# EAGLE design TDA7492 (EAGLE 9.1.2)
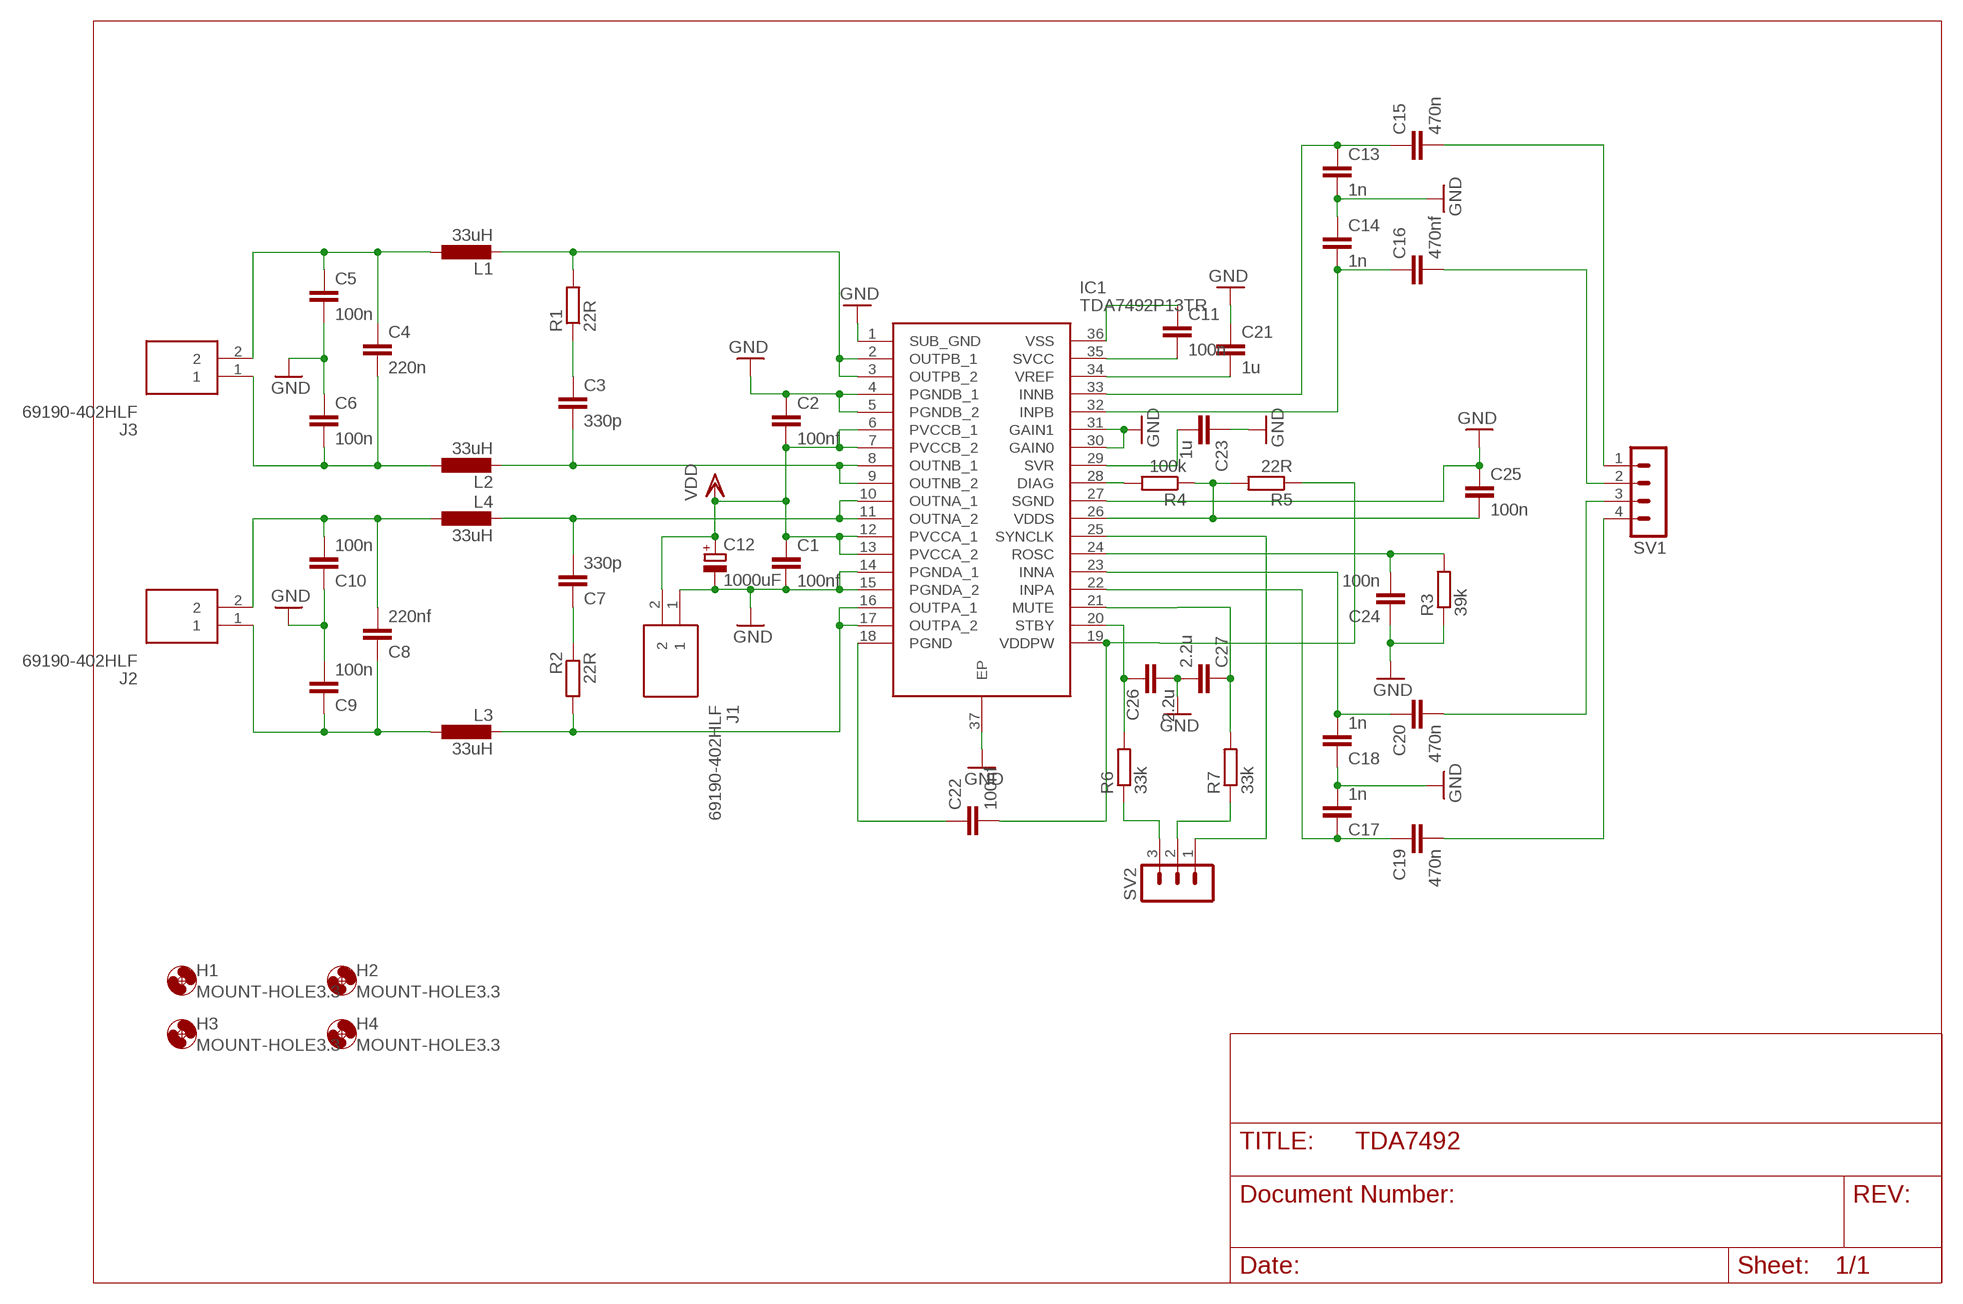
[diagram p0: schematic, sheet 1]

## Parts
C1  100nf  C-EUC0805  [C0805]
C2  100nf  C-EUC0805  [C0805]
C3  330p  C-EUC0805  [C0805]
C4  220n  C-EUC0805  [C0805]
C5  100n  C-EUC0805  [C0805]
C6  100n  C-EUC0805  [C0805]
C7  330p  C-EUC0805  [C0805]
C8  220nf  C-EUC0805  [C0805]
C9  100n  C-EUC0805  [C0805]
C10  100n  C-EUC0805  [C0805]
C11  100n  C-EUC0805  [C0805]
C12  1000uF  CPOL-EUE7.5-16  [E7,5-16]
C13  1n  C-EUC0805  [C0805]
C14  1n  C-EUC0805  [C0805]
C15  470n  C-EUC0805  [C0805]
C16  470nf  C-EUC0805  [C0805]
C17  1n  C-EUC0805  [C0805]
C18  1n  C-EUC0805  [C0805]
C19  470n  C-EUC0805  [C0805]
C20  470n  C-EUC0805  [C0805]
C21  1u  C-EUC0805  [C0805]
C22  100nf  C-EUC0805  [C0805]
C23  1u  C-EUC0805  [C0805]
C24  100n  C-EUC0805  [C0805]
C25  100n  C-EUC0805  [C0805]
C26  2.2u  C-EUC0805  [C0805]
C27  2.2u  C-EUC0805  [C0805]
H1  MOUNT-HOLE3.3  [3,3]
H2  MOUNT-HOLE3.3  [3,3]
H3  MOUNT-HOLE3.3  [3,3]
H4  MOUNT-HOLE3.3  [3,3]
IC1  TDA7492P13TR  [SOP50P1030X245-37N]
J1  69190-402HLF  [HDRV2W90P0X254_1X2_508X241X858]
J2  69190-402HLF  [HDRV2W90P0X254_1X2_508X241X858]
J3  69190-402HLF  [HDRV2W90P0X254_1X2_508X241X858]
L1  33uH  L-EUWE-TPC  [POWER-CHOKE_WE-TPC]
L2  33uH  L-EUWE-TPC  [POWER-CHOKE_WE-TPC]
L3  33uH  L-EUWE-TPC  [POWER-CHOKE_WE-TPC]
L4  33uH  L-EUWE-TPC  [POWER-CHOKE_WE-TPC]
R1  22R  R-EU_R0805  [R0805]
R2  22R  R-EU_R0805  [R0805]
R3  39k  R-EU_R0805  [R0805]
R4  100k  R-EU_R0805  [R0805]
R5  22R  R-EU_R0805  [R0805]
R6  33k  R-EU_R0805  [R0805]
R7  33k  R-EU_R0805  [R0805]
SV1  MA04-1  [MA04-1]
SV2  MA03-1  [MA03-1]

## Nets
GND: C1.2 C2.1 C5.2 C6.1 C9.2 C10.1 C12.- C13.2 C14.1 C17.2 C18.1 C21.1 C23.1 C24.1 C25.1 C26.2 C27.2 IC1.1(SUB_GND) IC1.4(PGNDB_1) IC1.5(PGNDB_2) IC1.14(PGNDA_1) IC1.15(PGNDA_2) IC1.27(SGND) IC1.30(GAIN0) IC1.31(GAIN1) IC1.37(EP) J1.1 R3.1
N$1: C4.2 C6.2 J3.1 L2.1
N$2: C4.1 C5.1 J3.2 L1.1
N$3: IC1.2(OUTPB_1) IC1.3(OUTPB_2) L1.2 R1.2
N$4: IC1.16(OUTPA_1) IC1.17(OUTPA_2) L3.2 R2.2
N$5: C3.2 IC1.8(OUTNB_1) IC1.9(OUTNB_2) L2.2
N$6: C11.2 IC1.35(SVCC)
N$7: C24.2 IC1.24(ROSC) R3.2
N$8: C3.1 R1.1
N$9: C23.2 IC1.29(SVR)
N$10: C14.2 C16.1 IC1.32(INPB)
N$11: C7.2 IC1.10(OUTNA_1) IC1.11(OUTNA_2) L4.2
N$12: C8.2 C10.2 J2.2 L4.1
N$13: C8.1 C9.1 J2.1 L3.1
N$14: C7.1 R2.1
N$15: C11.1 IC1.36(VSS)
N$16: C13.1 C15.1 IC1.33(INNB)
N$17: C22.1 IC1.18(PGND)
N$18: C17.1 C19.1 IC1.22(INPA)
N$19: C21.2 IC1.34(VREF)
N$20: C18.2 C20.1 IC1.23(INNA)
N$21: C22.2 IC1.19(VDDPW) R5.1
N$22: C15.2 SV1.1
N$23: C16.2 SV1.2
N$24: C20.2 SV1.3
N$25: C19.2 SV1.4
N$27: C27.1 IC1.21(MUTE) R7.2
N$28: IC1.28(DIAG) R4.2
N$29: C25.2 IC1.26(VDDS) R4.1 R5.2
N$30: IC1.25(SYNCLK) SV2.1
N$32: C26.1 IC1.20(STBY) R6.2
N$33: R6.1 SV2.3
N$34: R7.1 SV2.2
VDD: C1.1 C2.2 C12.+ IC1.6(PVCCB_1) IC1.7(PVCCB_2) IC1.12(PVCCA_1) IC1.13(PVCCA_2) J1.2

## Library data of the parts
C1-C11 C13-C27 = rcl-vito:C-EU: CAPACITOR, European symbol
C12 = rcl-vito:CPOL-EU: POLARIZED CAPACITOR, European symbol
H1-H4 = holes:MOUNT-HOLE: MOUNTING HOLE with drill center marker
IC1 = TDA7492P13TR:TDA7492P13TR: Audio Amplifiers 50W Mono BTL Class D 10 to 26V 4Select dB Source: Datasheet <https://componentsearchengine.com//TDA7492P13TR.pdf>; DESCRIPTION: Audio Amplifiers 50W Mono BTL Class D 10 to 26V 4Select dB; HEIGHT: 2.45mm; MANUFACTURER_NAME: STMicroelectronics; MANUFACTURER_PART_NUMBER: TDA7492P13TR; MOUSER2_PART_NUMBER: 511-TDA7492P13TR; MOUSER2_PRICE-STOCK: https://www.mouser.com/Search/Refine.aspx?Keyword=511-TDA7492P13TR
J1-J3 = 69190-402HLF:69190-402HLF: FCI,Header 2 way unshrouded FCI, Series Number 69190, 2.54mm Pitch 2 Way 1 Row Straight Header, Solder Termination Source: Datasheet <https://cdn.amphenol-icc.com/media/wysiwyg/files/drawing/69190.pdf>; ALLIED_NUMBER: 70302517; ALLIED_PRICE-STOCK: https://www.alliedelec.com/amphenol-fci-69190-402hlf/70302517/; ARROW_PART_NUMBER: 69190-402HLF; ARROW_PRICE-STOCK: https://www.arrow.com/en/products/69190-402hlf/amphenol-fci; DESCRIPTION: FCI,Header 2 way unshrouded FCI, Series Number 69190, 2.54mm Pitch 2 Way 1 Row Straight Header, Solder Termination; HEIGHT: 8.58mm; MANUFACTURER_NAME: FCI; MANUFACTURER_PART_NUMBER: 69190-402HLF; RS_PART_NUMBER: 8632731; RS_PRICE-STOCK: http://uk.rs-online.com/web/p/products/8632731
L1-L4 = rcl-vito:L-EU: INDUCTOR, European symbol
R1-R7 = rcl-vito:R-EU_: RESISTOR, European symbol
SV1 = con-lstb:MA04-1: PIN HEADER; OC_FARNELL: unknown; OC_NEWARK: unknown
SV2 = con-lstb:MA03-1: PIN HEADER; OC_FARNELL: unknown; OC_NEWARK: unknown

## Board
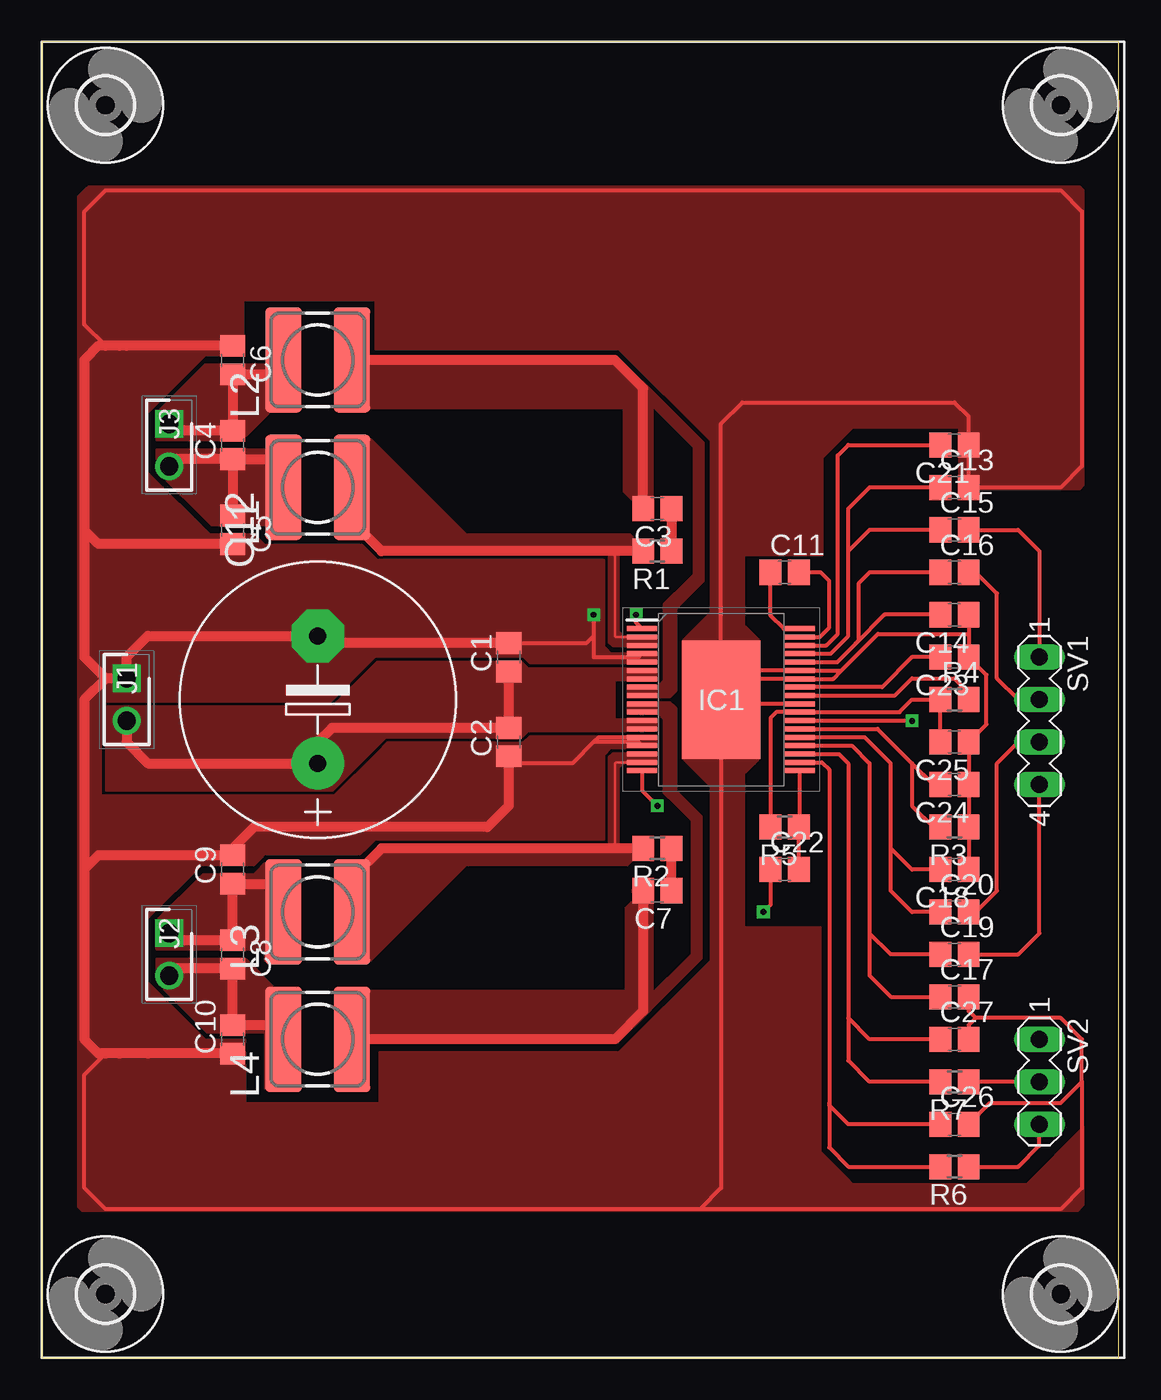
[diagram p1: board, top side]
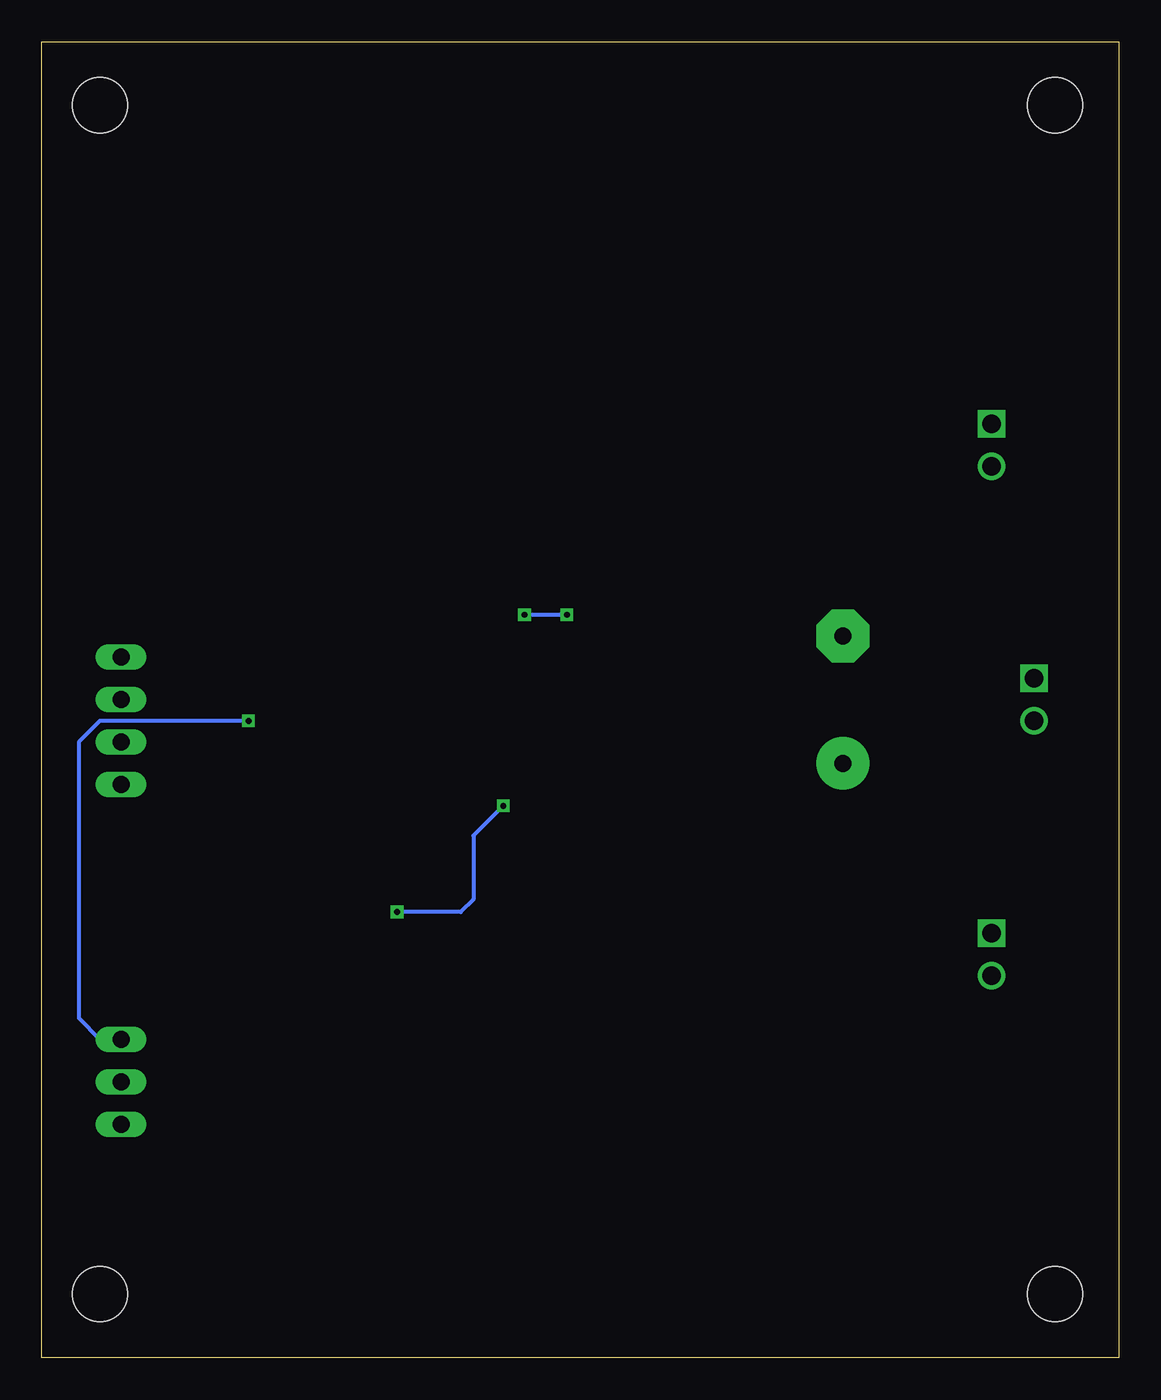
[diagram p2: board, bottom side, seen from below]

Size 64.44 x 78.73 mm. Coordinates in mm from the lower left corner, seen from the top.
Outline: 0,0 64.44,0 64.44,78.73 0,78.73 0,0
Copper layers (1*16): Top 0.035mm / dielectric 1.5mm / Bottom 0.035mm
Design rules "default *": minimum track width 6mil, minimum drill 0.35mm, track to track 6mil, track to pad 6mil, pad to pad 6mil, via to via 6mil, smd to smd 6mil, copper to edge 40mil, drill to drill 6mil, minimum pad ring 10mil, minimum via ring 8mil, stop-mask expansion 4mil, vias tented up to drill 0mil, thermal gap 0mil

### Footprints (pad centres in the part's own frame; a part is rotated, then mirrored left to right if it is on the bottom)
C0805 = smd 1.3 x 1.5: 1 -0.85,0; 2 0.85,0
E7,5-16 = drill 1.016 pad 3.15: + -3.81,0 | drill 1.016 pad 3.15 octagon: - 3.81,0
3,3 = hole 3.3: 0,0
SOP50P1030X245-37N = smd 1.8 x 0.3: 1 -4.725,4.25; 2 -4.725,3.75; 3 -4.725,3.25; 4 -4.725,2.75; 5 -4.725,2.25; 6 -4.725,1.75; 7 -4.725,1.25; 8 -4.725,0.75; 9 -4.725,0.25; 10 -4.725,-0.25; 11 -4.725,-0.75; 12 -4.725,-1.25; 13 -4.725,-1.75; 14 -4.725,-2.25; 15 -4.725,-2.75; 16 -4.725,-3.25; 17 -4.725,-3.75; 18 -4.725,-4.25; 19 4.725,-4.25; 20 4.725,-3.75; 21 4.725,-3.25; 22 4.725,-2.75; 23 4.725,-2.25; 24 4.725,-1.75; 25 4.725,-1.25; 26 4.725,-0.75; 27 4.725,-0.25; 28 4.725,0.25; 29 4.725,0.75; 30 4.725,1.25; 31 4.725,1.75; 32 4.725,2.25; 33 4.725,2.75; 34 4.725,3.25; 35 4.725,3.75; 36 4.725,4.25 | smd 4.7 x 7.1: 37 0,0
HDRV2W90P0X254_1X2_508X241X858 = drill 1.1 pad 1.65 square: 1 0,0 | drill 1.1 pad 1.65: 2 2.54,0
POWER-CHOKE_WE-TPC = smd 6.3 x 2.2: 1 0,2.05; 2 0,-2.05
R0805 = smd 1.3 x 1.5: 1 -0.85,0; 2 0.85,0
MA04-1 = drill 1.016 long: 1 -3.81,0; 2 -1.27,0; 3 1.27,0; 4 3.81,0
MA03-1 = drill 1.016 long: 1 -2.54,0; 2 0,0; 3 2.54,0

### Placement (x,y rotation side)
C1  27.94,41.91 90 top
C2  27.94,36.83 90 top
C3  36.83,50.8 180 top
C4  11.43,54.61 90 top
C5  11.43,49.53 270 top
C6  11.43,59.69 270 top
C7  36.83,27.94 180 top
C8  11.43,24.13 270 top
C9  11.43,29.21 90 top
C10  11.43,19.05 90 top
C11  44.45,46.99 0 top
C12  16.51,39.37 90 top
C13  54.61,52.07 0 top
C14  54.61,44.45 180 top
C15  54.61,49.53 0 top
C16  54.61,46.99 0 top
C17  54.61,21.59 0 top
C18  54.61,29.21 180 top
C19  54.61,24.13 0 top
C20  54.61,26.67 0 top
C21  54.61,54.61 180 top
C22  44.45,29.21 0 top
C23  54.61,41.91 180 top
C24  54.61,34.29 180 top
C25  54.61,36.83 180 top
C26  54.61,13.97 0 top
C27  54.61,19.05 0 top
H1  3.81,3.81 0 top
H2  3.81,74.93 0 top
H3  60.96,3.81 0 top
H4  60.96,74.93 0 top
IC1  40.64,39.37 0 top
J1  5.08,40.64 270 top
J2  7.62,25.4 270 top
J3  7.62,55.88 270 top
L1  16.51,52.07 90 top
L2  16.51,59.69 90 top
L3  16.51,26.67 90 top
L4  16.51,19.05 90 top
R1  36.83,48.26 180 top
R2  36.83,30.48 180 top
R3  54.61,31.75 180 top
R4  54.61,39.37 0 top
R5  44.45,31.75 180 top
R6  54.61,11.43 180 top
R7  54.61,16.51 180 top
SV1  59.69,38.1 270 top
SV2  59.69,16.51 270 top

### Tracks (layer width: path | path; a pad name or v marks a point on that pad's centre or on a via)
GND  (via drill 0.35)
  Top 0.254: C26.2 56.73,15.24 60.96,15.24 62.23,16.51 | C18.1 R3.1 C24.1 C25.1 56.52,37.88 56.52,40.85 C23.1 55.46,43.31 | 62.23,16.51 62.23,19.05 60.96,20.32 55.88,20.32 | 55.88,20.32 55.46,20.74 C17.2 | 55.88,20.32 55.46,19.9 C27.2 | C14.1 55.46,43.31 | 47.85,41.12 IC1.31 42.39,41.12 41.91,40.64 | 55.46,43.31 50.04,43.31 47.85,41.12 | 47.85,41.12 47.35,40.62 IC1.30 41.93,40.62 41.91,40.64 | IC1.37 40.64,40.64 | 40.64,40.64 40.64,55.88 41.91,57.15 54.61,57.15 55.46,56.3 C21.1 C13.2 60.96,52.07 62.23,53.34 62.23,68.58 60.96,69.85 3.81,69.85 2.54,68.58 2.54,61.81 3.81,60.54 | 41.91,40.64 40.64,40.64 | IC1.27 40.89,39.12 IC1.37 | IC1.1 35.56,43.98 v35.56,44.45 | v33.02,44.45 33.02,43.18 | 33.02,43.18 33.02,41.91 35.7,41.91 IC1.4 | C1.2 32.6,42.76 33.02,43.18 | IC1.14 33.31,37.12 33.02,36.83 | 33.02,36.83 31.75,35.56 27.94,35.56 | IC1.15 35.7,36.83 33.02,36.83 | 62.23,16.51 62.23,10.16 60.96,8.89 39.37,8.89 | 3.81,18.2 2.54,16.93 2.54,10.16 3.81,8.89 39.37,8.89 | IC1.37 40.64,10.16 39.37,8.89
  Top 0.61: C6.1 5.08,60.54 | 5.08,60.54 4.66,60.54 | C1.2 16.93,42.76 C12.- 6.35,43.18 5.08,41.91 J1.1 3.81,40.64 | 5.08,30.06 C9.2 11.43,30.48 12.7,31.75 26.67,31.75 27.94,33.02 27.94,35.56 C2.1 | 5.08,30.06 4.66,30.06 | C10.1 6.35,18.2 | 6.35,18.2 4.66,18.2 | 2.54,29.21 2.54,38.1 2.54,39.37 3.81,40.64 | 2.54,29.21 2.54,19.05 3.39,18.2 3.81,18.2 6.35,18.2 | 3.81,40.64 2.54,41.91 2.54,49.53 | 5.08,60.54 3.81,60.54 3.39,60.54 2.54,59.69 2.54,49.53 | 2.54,49.53 3.39,48.68 C5.2 | 5.08,30.06 3.39,30.06 2.54,29.21
  Bottom 0.254: v35.56,44.45 v33.02,44.45
  pour Top: 38.35,35.81 40.01,34.16 40.01,30.35 40.01,10.79 38.35,9.14 38.35,8.76 42.29,8.76 42.8,8.76 42.93,8.76 42.93,9.14 41.27,10.79 41.27,34.16 42.93,35.81
  pour Top: 2.54,19.05 12.19,19.05 12.19,17.65 12.19,15.24 15.24,15.24 46.61,15.24 46.61,13.46 46.61,12.32 48.13,10.79 48.51,10.41 57.4,10.41 62.23,10.41 62.36,10.29 62.36,10.03 61.09,8.76 60.71,8.76 2.92,8.76 2.41,9.27 2.41,10.29 2.54,10.41
  pour Top: 40.01,23.75 34.54,18.29 33.27,18.29 20.7,18.29 20.19,18.29 20.19,15.11 46.61,15.11 46.61,19.18 46.61,25.53 46.61,25.78 42.04,25.78 42.04,70.1 41.02,70.1 40.01,70.1 40.01,26.29
  pour Top: 2.92,8.76 2.16,9.53 2.16,68.45 3.68,69.98 42.04,69.98 38.1,66.04 11.81,66.04 6.22,66.04 2.67,62.48 2.92,62.23 2.92,9.4
  pour Top: 40.01,44.58 40.01,45.85 42.04,45.85 42.04,44.7 42.04,43.81
  pour Top: 40.26,44.83 40.39,44.83 41.02,44.83
  pour Top: 36.07,37.08 36.07,37.21 33.27,37.21 29.21,37.21 28.83,36.83 27.69,36.83 21.08,36.83 20.7,36.83 20.07,36.2 17.53,33.66 5.59,33.66 3.56,33.66 3.56,34.29 3.56,39.24 3.94,39.24 16.89,39.24 17.27,39.24 19.56,41.53 19.94,41.91 28.7,41.91 28.83,41.91 29.21,41.53 36.83,41.53 36.83,42.16 34.04,42.16 33.78,42.42 33.66,42.55 33.66,43.18 33.66,47.75 33.27,47.75 20.07,47.75 19.18,48.64 17.14,48.64 13.34,48.64 12.7,49.28 12.19,49.28 10.03,49.28 6.35,52.96 6.35,56.52 9.78,59.94 12.06,59.94 12.06,61.09 2.16,61.09 2.16,59.94 2.16,29.97 5.08,29.97 10.41,29.97 10.92,29.46 12.19,29.46 12.7,29.46 13.08,29.84 13.34,30.1 14.99,30.1 19.05,30.1 19.43,30.48 19.94,30.99 20.45,30.99 33.66,30.99 33.66,31.5 33.66,36.07 34.04,36.45 35.94,36.45 36.07,36.45
  pour Top: 34.92,36.45 36.83,36.45 36.83,37.21 34.92,37.21
  pour Top: 38.35,42.93 40.01,44.58 40.64,44.58 41.27,44.58 42.93,42.93 42.93,42.67 38.35,42.67
  pour Top: 40.01,54.86 34.54,60.33 33.91,60.33 20.32,60.33 19.94,60.33 19.94,60.96 19.94,63.25 16.26,63.25 12.06,63.25 12.06,59.94 2.41,59.94 2.41,63.5 2.29,63.5 2.16,63.63 2.16,69.47 2.67,69.98 2.79,70.1 3.94,70.1 62.1,70.1 62.36,69.85 62.36,52.2 62.1,51.94 54.99,51.94 54.86,52.07 54.86,55.63 53.59,55.63 48.51,55.63 47.24,54.36 46.74,53.85 46.74,48.01 42.04,48.01 40.77,48.01 40.77,53.72 40.01,53.72
  pour Top: 60.96,8.76 61.98,8.76 62.23,9.02 62.36,9.14 62.36,10.29 62.36,13.84 58.93,10.41 56.39,10.41 55.88,9.91 55.88,8.89 56.01,8.76
  pour Top: 3.05,8.76 2.41,8.76 2.16,9.02 2.16,10.67 2.29,10.79 3.3,10.79 3.43,10.67 3.43,9.02 3.17,8.76
  pour Top: 6.35,30.48 6.35,19.05 2.54,19.05 2.54,31.75 6.35,31.75
  pour Top: 6.22,22.86 6.35,22.73 6.35,22.48 9.78,19.05 5.46,19.05 5.46,30.48 10.16,30.48 10.16,29.84 10.41,29.84 10.92,30.35 11.43,30.35 11.43,29.84 11.43,29.46 10.29,29.46 9.53,29.46 6.35,26.29 6.35,22.99
N$1
  Top 0.61: L2.1 15.24,59.69 14.39,58.84 C6.2 C4.2 8.04,55.46 J3.1
  pour Top: 12.06,54.99 13.72,56.64 13.84,56.64 13.84,59.31 13.72,59.44 10.67,59.44 9.78,59.44 6.86,56.52 6.86,54.99 6.86,54.86 11.94,54.86
N$2
  Top 0.61: C4.1 C5.1 | C4.1 13.55,53.76 14.46,52.85 L1.1 | C4.1 8.04,53.76 J3.2
  pour Top: 13.72,54.36 10.67,54.36 6.86,54.36 6.86,53.09 10.16,49.78 11.18,49.78 13.72,49.78
N$3
  Top 0.152: IC1.2 34.35,43.12 34.29,43.18 34.29,48.26
  Top 0.61: R1.2 34.29,48.26 20.32,48.26 18.56,50.02 L1.2
  pour Top: 36.83,42.55 34.8,42.55 34.16,42.55 33.91,42.8 33.91,48.26 34.04,48.39 34.8,48.39 34.54,48.13 34.54,43.43 34.67,43.31 34.8,43.18 36.45,43.18 36.83,43.18
  pour Top: 36.45,48.9 25.78,48.9 19.56,55.12 17.78,55.12 17.65,54.99 17.65,50.67 19.56,48.77 20.19,48.13 36.2,48.13 36.45,48.39
  pour Top: 35.56,48.9 35.18,49.28 34.8,49.28 25.15,49.28 25.02,49.15 25.91,48.26 26.04,48.26 34.92,48.26
N$4
  Top 0.152: IC1.17 34.35,35.62 34.29,35.56 34.29,30.48
  Top 0.61: R2.2 34.29,30.48 20.32,30.48 18.56,28.72 L3.2
  pour Top: 36.58,36.2 34.29,36.2 34.16,36.2 33.91,35.94 33.91,30.48 34.54,30.48 34.54,34.04 34.54,35.31 34.8,35.56 36.7,35.56 36.83,35.56 36.83,36.2
  pour Top: 18.41,23.62 19.56,23.62 19.68,23.75 26.16,30.23 26.54,30.23 36.58,30.23 36.58,30.73 20.32,30.73 20.07,30.48 18.41,28.83
  pour Top: 35.81,30.1 35.69,30.1 35.05,29.46 20.45,29.46 20.45,30.61 36.07,30.61 36.07,30.1 35.94,30.1
N$5
  Top 0.61: C3.2 35.98,58 34.29,59.69 L2.2
  pour Top: 35.05,40.26 35.05,39.5 36.7,39.5 37.59,39.5 37.97,39.88 37.97,44.83 39.62,46.48 39.62,54.74 35.94,58.42 35.69,58.17 35.56,58.04 35.94,57.66 35.94,57.53 36.07,57.4 38.99,54.48 38.99,54.36 38.99,46.86 38.61,46.48 37.21,45.09 37.21,44.32 37.21,40.51 36.96,40.26
  pour Top: 18.54,56.64 19.43,56.64 19.56,56.64 19.68,56.77 22.35,59.44 24.64,59.44 27.3,59.44 27.69,59.82 19.18,59.82 18.92,59.56 18.54,59.18
  pour Top: 35.43,50.16 35.43,51.18 34.8,51.82 34.8,57.66 34.29,58.17 33.91,58.55 21.46,58.55 21.46,59.44 21.34,59.56 34.16,59.56 35.81,57.91 36.58,57.15 36.58,51.44 36.58,50.16
  pour Top: 19.05,62.23 19.05,59.69 34.29,59.69 35.56,58.42 35.56,57.15 19.05,57.15 17.78,57.15 17.78,62.23
  pour Top: 19.05,57.15 17.78,57.15 17.78,62.23 19.05,62.23 19.05,59.69 34.29,59.69 34.29,58.42 35.56,58.42 35.56,57.15 35.56,56.77 19.43,56.77 18.92,56.77 18.92,56.9 19.05,56.9
N$6
  Top 0.254: IC1.35 46.55,43.12 47.12,43.69 47.12,46.48 46.61,46.99 C11.2
N$7
  Top 0.254: IC1.24 50.01,37.62 52.07,35.56 | R3.2 53.34,31.75 52.07,33.02 52.07,35.56 | C24.2 53.34,34.29 52.07,35.56
N$8
  Top 0.61: C3.1 R1.1
N$9
  Top 0.254: C23.2 52.07,41.91 50.28,40.12 IC1.29
N$10
  Top 0.254: C16.1 49.53,46.99 48.9,46.35 48.9,42.93 48.7,42.74 | IC1.32 47.59,41.62 48.7,42.74 | C14.2 50.42,44.45 48.7,42.74
N$11
  Top 0.61: C7.2 35.98,20.74 34.29,19.05 L4.2
  pour Top: 35.05,39.24 37.59,39.24 37.85,38.99 37.97,38.86 37.97,33.91 38.23,33.66 39.5,32.38 39.5,26.16 39.5,23.88 35.94,20.32 35.69,20.57 35.56,20.7 36.07,21.21 36.07,21.34 38.86,24.13 38.86,24.64 38.86,32.13 37.85,33.15 37.21,33.78 37.21,34.92 37.21,38.23 36.96,38.48 35.05,38.48
  pour Top: 18.67,21.97 19.56,21.97 22.23,19.3 23.11,19.3 33.91,19.3 35.69,21.08 35.69,27.3 36.2,27.3 36.58,27.3 36.58,20.95 36.32,20.7 34.42,18.8 18.54,18.8 18.67,18.92
  pour Top: 36.58,28.7 35.31,28.7 35.31,27.3 34.92,26.92 34.92,21.97 17.65,21.97 17.65,20.32 18.54,19.43 21.84,19.43 22.23,19.05 34.04,19.05 34.54,19.56 36.2,21.21 36.2,25.15 36.2,28.32
N$12
  Top 0.61: J2.2 8.04,23.28 C8.2 C10.2 13.55,19.9 13.97,20.32 14.46,19.83 L4.1
  pour Top: 12.19,23.88 6.86,23.88 6.86,22.61 6.86,22.48 9.91,19.43 10.41,19.43 12.19,19.43 12.7,19.43 13.34,19.43 13.34,16.13 13.46,16 15.37,16 15.49,16.13 15.49,21.97 15.37,22.1 13.97,22.1
N$13
  Top 0.61: J2.1 8.04,24.98 C8.1 C9.1 13.55,28.36 14.46,27.45 L3.1
  pour Top: 6.86,26.16 9.65,28.96 10.67,28.96 12.06,28.96 12.7,28.96 13.46,29.72 15.49,29.72 15.49,23.62 13.46,23.62 13.34,23.75 13.34,24.38 10.67,24.38 6.86,24.38
N$14
  Top 0.61: C7.1 R2.1
N$15
  Top 0.254: IC1.36 44.39,43.62 43.6,44.41 C11.1
N$16
  Top 0.254: C13.1 49.53,52.07 48.26,50.8 48.26,48.26 | 48.26,48.26 48.26,43.18 47.2,42.12 IC1.33 | C15.1 49.53,49.53 48.26,48.26
N$17  (via drill 0.35)
  Top 0.254: IC1.18 35.91,33.94 v36.83,33.02 | C22.1 43.6,27.09 v43.18,26.67
  Bottom 0.254: v43.18,26.67 39.37,26.67 38.61,27.43 38.61,31.24 v36.83,33.02
N$18
  Top 0.254: IC1.22 48.47,36.62 49.53,35.56 49.53,25.4 | 49.53,25.4 49.53,22.86 50.8,21.59 C17.1 | C19.1 50.8,24.13 49.53,25.4
N$19
  Top 0.254: IC1.34 46.94,42.62 47.62,43.31 47.62,53.98 48.26,54.61 C21.2
N$20
  Top 0.254: C20.1 52.07,26.67 50.8,27.94 50.8,30.48 | 50.8,30.48 50.8,35.56 49.24,37.12 IC1.23 | C18.2 52.07,29.21 50.8,30.48
N$21
  Top 0.254: 45.37,29.27 C22.2 R5.1 45.37,31.82 IC1.19
N$22
  Top 0.254: C15.2 58.42,49.53 59.69,48.26 SV1.1
N$23
  Top 0.254: SV1.2 58.42,39.37 57.15,40.64 57.15,45.72 55.88,46.99 C16.2
N$24
  Top 0.254: C20.2 55.88,26.67 57.15,27.94 57.15,35.56 58.42,36.83 SV1.3
N$25
  Top 0.254: C19.2 58.42,24.13 59.69,25.4 SV1.4
N$27
  Top 0.254: R7.2 49.53,16.51 48.26,17.78 48.26,20.32 | 48.26,20.32 48.26,35.56 47.7,36.12 IC1.21 | C27.1 49.53,19.05 48.26,20.32
N$28
  Top 0.254: IC1.28 51.05,39.62 52.07,40.64 54.61,40.64 55.88,39.37 R4.2
N$29
  Top 0.254: R5.2 43.6,38.27 43.95,38.62 IC1.26 51.32,38.62 52.07,39.37 R4.1 C25.2
N$30  (via drill 0.35)
  Top 0.254: IC1.25 52.05,38.12 v52.07,38.1
  Bottom 0.254: v52.07,38.1 60.96,38.1 62.23,36.83 62.23,20.32 60.96,19.05 SV2.1
N$32
  Top 0.254: IC1.20 46.68,35.62 47.12,35.18 47.12,15.24 | 47.12,15.24 47.12,12.57 48.26,11.43 R6.2 | C26.1 48.26,13.97 47.12,15.11 47.12,15.24
N$33
  Top 0.254: R6.1 58.42,11.43 59.69,12.7 SV2.3
N$34
  Top 0.254: SV2.2 R7.1
VDD
  Top 0.61: J1.2 5.08,36.83 6.35,35.56 C12.+ | C1.1 C2.2 17.36,37.68 16.51,36.83
  pour Top: 36.83,41.27 36.83,40.51 34.29,40.51 34.29,39.88 34.29,38.23 35.05,38.23 36.83,38.23 36.83,37.47 36.2,37.47 29.08,37.47 28.7,37.08 20.57,37.08 17.78,34.29 17.4,33.91 4.95,33.91 3.81,33.91 3.81,38.35 3.81,38.99 5.21,38.99 17.4,38.99 20.07,41.66 28.7,41.66 29.08,41.27 36.7,41.27